# EAGLE schematic air-quality (EAGLE 9.6.2)
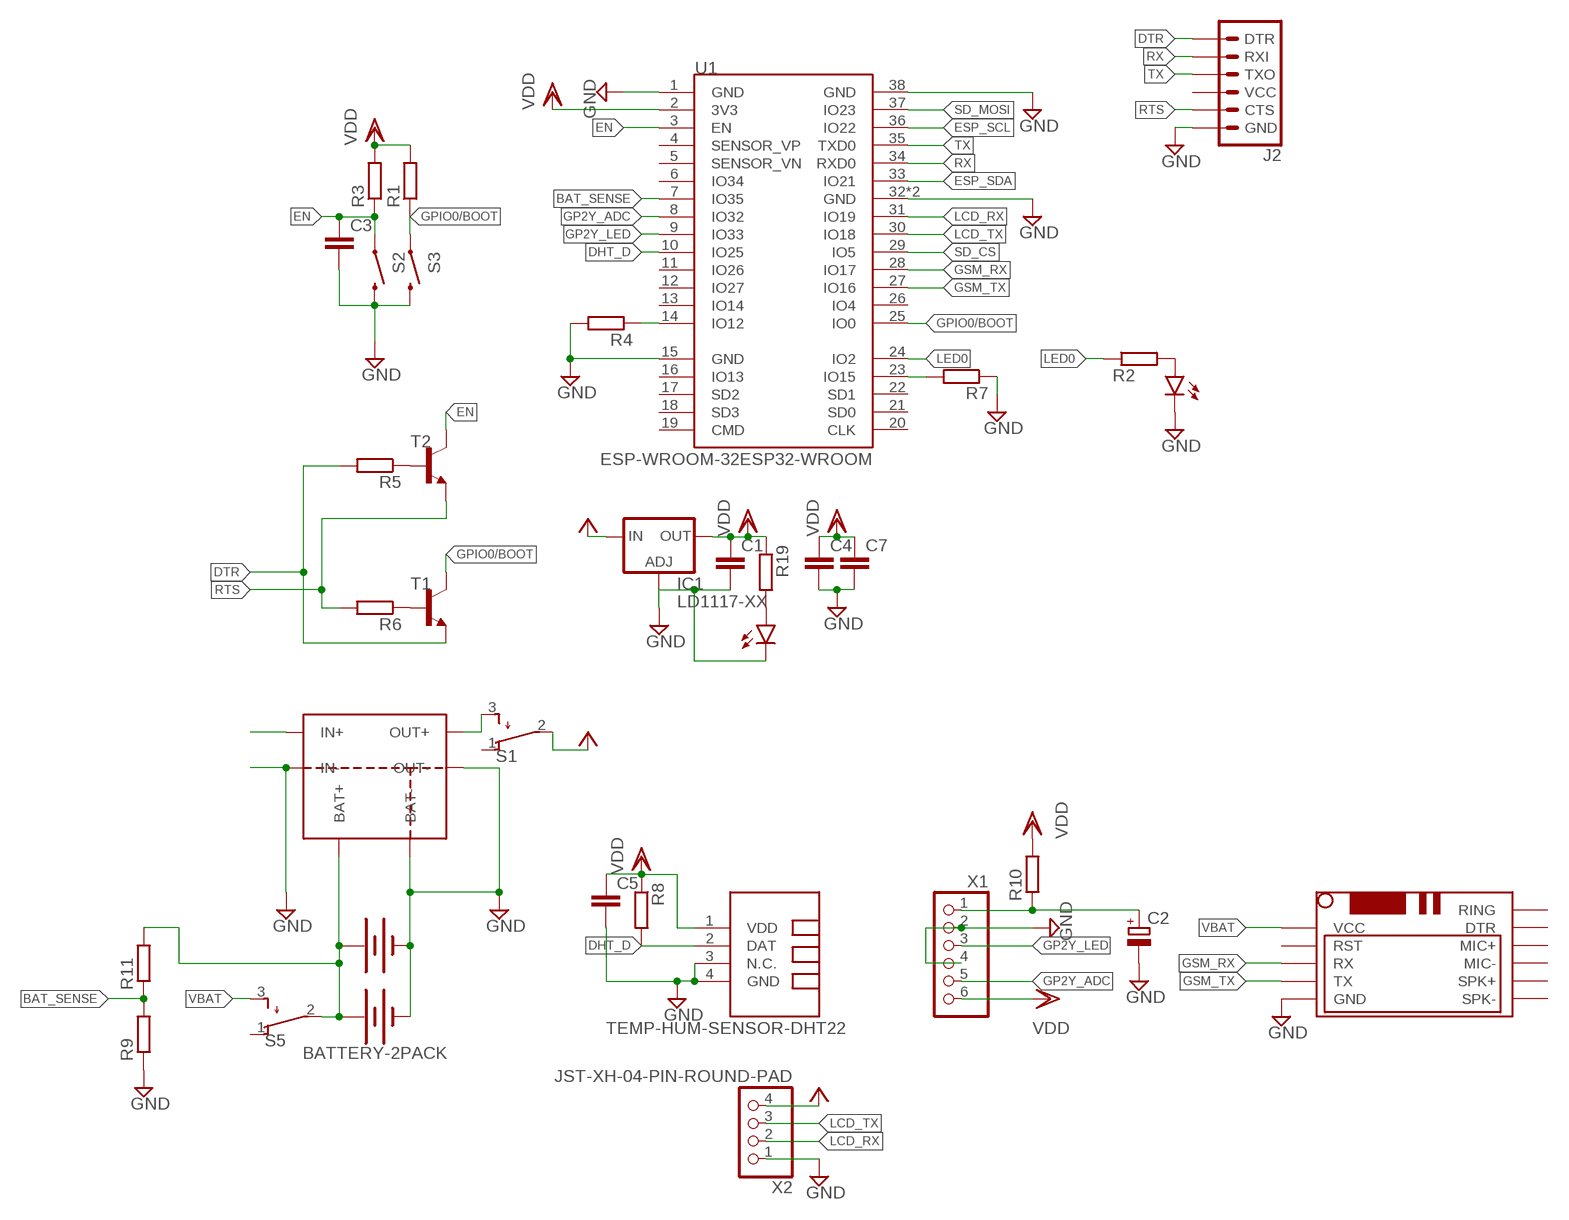
[diagram p0: schematic, sheet 1]

## Parts
C1  C-EUC0805  [C0805]
C2  CPOL-EUE2.5-6  [E2,5-6]
C3  C-EUC0805  [C0805]
C4  C-EUC0805  [C0805]
C5  C-EUC0805  [C0805]
C7  C-EUC0805  [C0805]
IC1  LD1117-XX  [SOT230P700X180-4N]
J2  6_PIN_SERIAL_TARGETFEMALE  [6_PIN_SERIAL_TARGET_SIDE_W_SILK-FEMALE]
LED12  LEDCHIP-LED0805  [CHIP-LED0805]
POW  LEDCHIP-LED0603  [CHIP-LED0603]
R1  R-EU_R0805  [R0805]
R2  R-EU_R0805  [R0805]
R3  R-EU_R0805  [R0805]
R4  R-EU_R0805  [R0805]
R5  R-EU_R0805  [R0805]
R6  R-EU_R0805  [R0805]
R7  R-EU_R0805  [R0805]
R8  R-EU_R0805  [R0805]
R9  R-EU_R0805  [R0805]
R10  R-EU_0204/7  [0204/7]
R11  R-EU_R0805  [R0805]
R19  R-EU_R0805  [R0805]
S1  TL32PO  [TL3XPO]
S2  ESP_BOOT  SPST-SWSMD-1101NE  [TACTILE-SWITCH-1101NE]
S3  ESP_EN  SPST-SWSMD-1101NE  [TACTILE-SWITCH-1101NE]
S5  TL32PO  [TL3XPO]
T1  BC808-NPN-SOT23-BEC  [SOT23-BEC]
T2  BC808-NPN-SOT23-BEC  [SOT23-BEC]
U1  ESP-WROOM-32ESP32-WROOM  [ESP-WROOM-32]
U$1  BMS-LITHIUM  [BMS-LITHIUM]
U$2  BATTERY-2PACK  [BATTERY-18650-HOLDER-2PACK-SMD]
U$3  TEMP-HUM-SENSOR-DHT22  [TEMP-HUM-SENSOR-DHT22]
U$4  SIM800LMODULE  [SIM800LMODULE]
X1  JST-XH-06-PIN-ROUND-PAD  [JST-XH-06-PACKAGE-ROUND-PAD]
X2  JST-XH-04-PIN-ROUND-PAD  [JST-XH-04-PACKAGE-ROUND-PAD]

## Nets
BAT_SENSE: R9.2 R11.1 U1.7(IO35)
DHT_D: R8.2 U1.10(IO25) U$3.2(DAT)
DTR: J2.1(DTR) R5.2 T1.E
EN: C3.1 R3.1 S2.1 T2.C U1.3(EN)
ESP_SCL: U1.36(IO22)
ESP_SDA: U1.33(IO21)
GND: C1.2 C2.- C3.2 C4.2 C5.2 C7.2 IC1.1(ADJ) J2.6(GND) LED12.C POW.C R4.2 R7.1 R9.1 S2.2 S3.2 U1.1(GND) U1.15(GND) U1.32(GND) U1.38(GND) U1.GND U$1.BAT- U$1.IN- U$1.OUT- U$2.-0 U$2.-1 U$3.3(N.C.) U$3.4(GND) U$4.GND X1.2 X1.4 X2.1
GP2Y_ADC: U1.8(IO32) X1.5
GP2Y_LED: U1.9(IO33) X1.3
GPIO0/BOOT: R1.1 S3.1 T1.C U1.25(IO0)
GSM_RX: U1.28(IO17) U$4.RX
GSM_TX: U1.27(IO16) U$4.TX
LCD_RX: U1.31(IO19) X2.2
LCD_TX: U1.30(IO18) X2.3
LED0: R2.1 U1.24(IO2)
N$1: R5.1 T2.B
N$2: R4.1 U1.14(IO12)
N$3: R7.2 U1.23(IO15)
N$4: LED12.A R2.2
N$5: R6.1 T1.B
N$6: U$1.IN+
N$7: C2.+ R10.1 X1.1
N$8: S1.3(S) U$1.OUT+
N$26: POW.A R19.2
RTS: J2.5(CTS) R6.2 T2.E
RX: J2.3(RXI) U1.34(RXD0)
SD_CS: U1.29(IO5)
SD_MOSI: U1.37(IO23)
TX: J2.2(TXO) U1.35(TXD0)
VB: R11.2 S5.2(P) U$1.BAT+ U$2.+0 U$2.+1
VBAT: S5.3(S) U$4.VCC
VCC: IC1.3(IN) S1.2(P) X2.4
VDD: C1.1 C4.1 C5.1 C7.1 IC1.2(OUT) IC1.4(OUT) R1.2 R3.2 R8.1 R10.2 R19.1 U1.2(3V3) U$3.1(VDD) X1.6
Unconnected: J2.4(VCC) S1.1(O) S5.1(O) U1.4(SENSOR_VP) U1.5(SENSOR_VN) U1.6(IO34) U1.11(IO26) U1.12(IO27) U1.13(IO14) U1.16(IO13) U1.17(SD2) U1.18(SD3) U1.19(CMD) U1.20(CLK) U1.21(SD0) U1.22(SD1) U1.26(IO4) U$4.DTR U$4.MIC+ U$4.MIC- U$4.RING U$4.RST U$4.SPK+ U$4.SPK-

## Library data of the parts
C1 C3-C5 C7 = common:C-EU: CAPACITOR, European symbol; SPICEPREFIX: C
C2 = common:CPOL-EU: POLARIZED CAPACITOR, European symbol; SPICEPREFIX: C
IC1 = common:LD1117-XX
J2 = connectors:6_PIN_SERIAL_TARGET: 6-pin header connection for use with the "FTDI BASIC" pinout - TARGET SIDE. Also known as "Arduino Serial Program Header". It is used to mate with our FTDI Basic serial programmers using the Arduino IDE. Note, this device has "TARGET" in the name. It is intended to be used on a design that contains a target micro-controller that you wish to program. The "sister" device, named "CABLE" is inteneded to be used on a design that usually lives on the end of your USB cable and prvides the converter chip (FTDI232 or FTDI231x) to commnicate serial RX/TX. You can populate with some of these: Break Away Headers - Straight <https://www.sparkfun.com/products/116> (PRT-00116) For reference (or to suit your programming needs) check out these designs: SparkFun FTDI Basic Breakout - 5V <https://www.sparkfun.com/products/9716> (DEV-09716) SparkFun FTDI Basic Breakout - 3.3V <https://www.sparkfun.com/products/9873> (DEV-09873) SparkFun FTDI SmartBasic <https://www.sparkfun.com/products/12935> (DEV-12935) SparkFun Beefy 3 - FTDI Basic Breakout <https://www.sparkfun.com/products/13746> (DEV-13746)
LED12 POW = common:LED: LED OSRAM: - CHIPLED LG R971, LG N971, LY N971, LG Q971, LY Q971, LO R971, LY R971 LH N974, LH R974 LS Q976, LO Q976, LY Q976 LO Q996 - Hyper CHIPLED LW Q18S LB Q993, LB Q99A, LB R99A - SideLED LS A670, LO A670, LY A670, LG A670, LP A670 LB A673, LV A673, LT A673, LW A673 LH A674 LY A675 LS A676, LA A676, LO A676, LY A676, LW A676 LS A679, LY A679, LG A679 - Hyper Micro SIDELED® LS Y876, LA Y876, LO Y876, LY Y876 LT Y87S - SmartLED LW L88C, LW L88S LB L89C, LB L89S, LG L890 LS L89K, LO L89K, LY L89K LS L896, LA L896, LO L896, LY L896 - TOPLED LS T670, LO T670, LY T670, LG T670, LP T670 LSG T670, LSP T670, LSY T670, LOP T670, LYG T670 LG T671, LOG T671, LSG T671 LB T673, LV T673, LT T673, LW T673 LH T674 LS T676, LA T676, LO T676, LY T676, LB T676, LH T676, LSB T676, LW T676 LB T67C, LV T67C, LT T67C, LS T67K, LO T67K, LY T67K, LW E67C LS E67B, LA E67B, LO E67B, LY E67B, LB E67C, LV E67C, LT E67C LW T67C LS T679, LY T679, LG T679 LS T770, LO T770, LY T770, LG T770, LP T770 LB T773, LV T773, LT T773, LW T773 LH T774 LS E675, LA E675, LY E675, LS T675 LS T776, LA T776, LO T776, LY T776, LB T776 LHGB T686 LT T68C, LB T68C - Hyper Mini TOPLED® LB M676 - Mini TOPLED Santana® LG M470 LS M47K, LO M47K, LY M47K Source: http://www.osram.convergy.de LUXEON: - LUMILED® LXK2-PW12-R00, LXK2-PW12-S00, LXK2-PW14-U00, LXK2-PW14-V00 LXK2-PM12-R00, LXK2-PM12-S00, LXK2-PM14-U00 LXK2-PE12-Q00, LXK2-PE12-R00, LXK2-PE12-S00, LXK2-PE14-T00, LXK2-PE14-U00 LXK2-PB12-K00, LXK2-PB12-L00, LXK2-PB12-M00, LXK2-PB14-N00, LXK2-PB14-P00, LXK2-PB14-Q00 LXK2-PR12-L00, LXK2-PR12-M00, LXK2-PR14-Q00, LXK2-PR14-R00 LXK2-PD12-Q00, LXK2-PD12-R00, LXK2-PD12-S00 LXK2-PH12-R00, LXK2-PH12-S00 LXK2-PL12-P00, LXK2-PL12-Q00, LXK2-PL12-R00 Source: www.luxeon.com KINGBRIGHT: KA-3528ASYC Source: www.kingbright.com
R1-R11 R19 = common:R-EU_: RESISTOR, European symbol; SPICEPREFIX: R
S1 S5 = switch:TL32PO: TINY SWITCH ON - MOM Source: http://www2.produktinfo.conrad.com/datenblaetter/700000-724999/705152-da-01-de-Subminiaturschalter_TL_36YO.pdf
S2 S3 = common:SPST-SW: 6x3.5mm 2-pin Momentary Switch (Push-button) Digikey Link <https://www.digikey.com/products/en?keywords=CKN10388TR-ND> Datasheet <https://media.digikey.com/pdf/Data%20Sheets/C&K/RS-032G05_-SM_RT.pdf>; PROD_ID: SWCH-00815
T1 T2 = common:*-NPN-: NPN Transistror BF959 corrected 2008.03.06
U1 = common:ESP-WROOM-32: Espressif Systems ESP-WROOM-32
U$1 = common:BMS-LITHIUM
U$2 = common:BATTERY-2PACK
U$3 = dht22:TEMP-HUM-SENSOR-DHT22: DHT22 - digital humidity & temperature sensor Also known as: AM2302 AM2302 datasheet available here: http://akizukidenshi.com/download/ds/aosong/AM2302.pdf Click here to find device on ebay.com <http://www.ebay.com/sch/dht22+digital+sensor>
U$4 = common:SIM800LMODULE: SIM800L Module
X1 = common:JST-XH-06-PIN: JST XH Connector 2 Pin Wire to board connector. Pitch: 2,54 mm, (0.100") Number of pins: 6 Created by Rembrandt Electronics www.rembrandtelectronics.com
X2 = common:JST-XH-04-PIN: JST XH Connector 2 Pin Wire to board connector. Pitch: 2,54 mm, (0.100") Number of pins: 4 Created by Rembrandt Electronics www.rembrandtelectronics.com